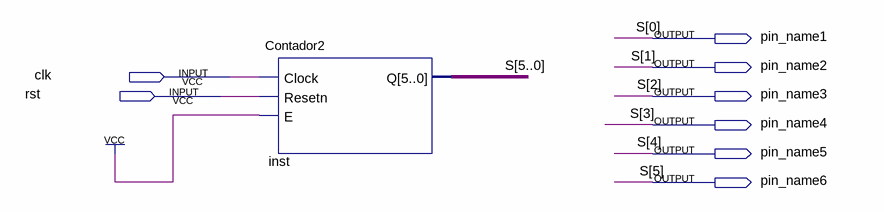
[diagram p0: schematic sheet]
// Quartus schematic Block1.bdf as structural Verilog: 1 symbols, 8 pins
module Block1 (
  input  clk,
  input  rst,
  output pin_name1,
  output pin_name2,
  output pin_name3,
  output pin_name4,
  output pin_name5,
  output pin_name6
);

  Contador2 inst (
    .Clock(clk), .Resetn(rst), .E(1'b1),
    .Q({pin_name6, pin_name5, pin_name4, pin_name3, pin_name2, pin_name1}));

  // Other names for the same wires on the sheet: S[5:0] = {pin_name6, pin_name5, pin_name4, pin_name3, pin_name2, pin_name1}
endmodule
